# EasyEDA Pro project PowerManager.eprj

# Schematic Schematic1
Create Date: 2024-06-30; Page Name: P1; Project Name: PowerManager; Schematic Name: Schematic1; Update Date: 2024-07-23; Company: 嘉立创EDA; Page Size: A4; Version: V1.0
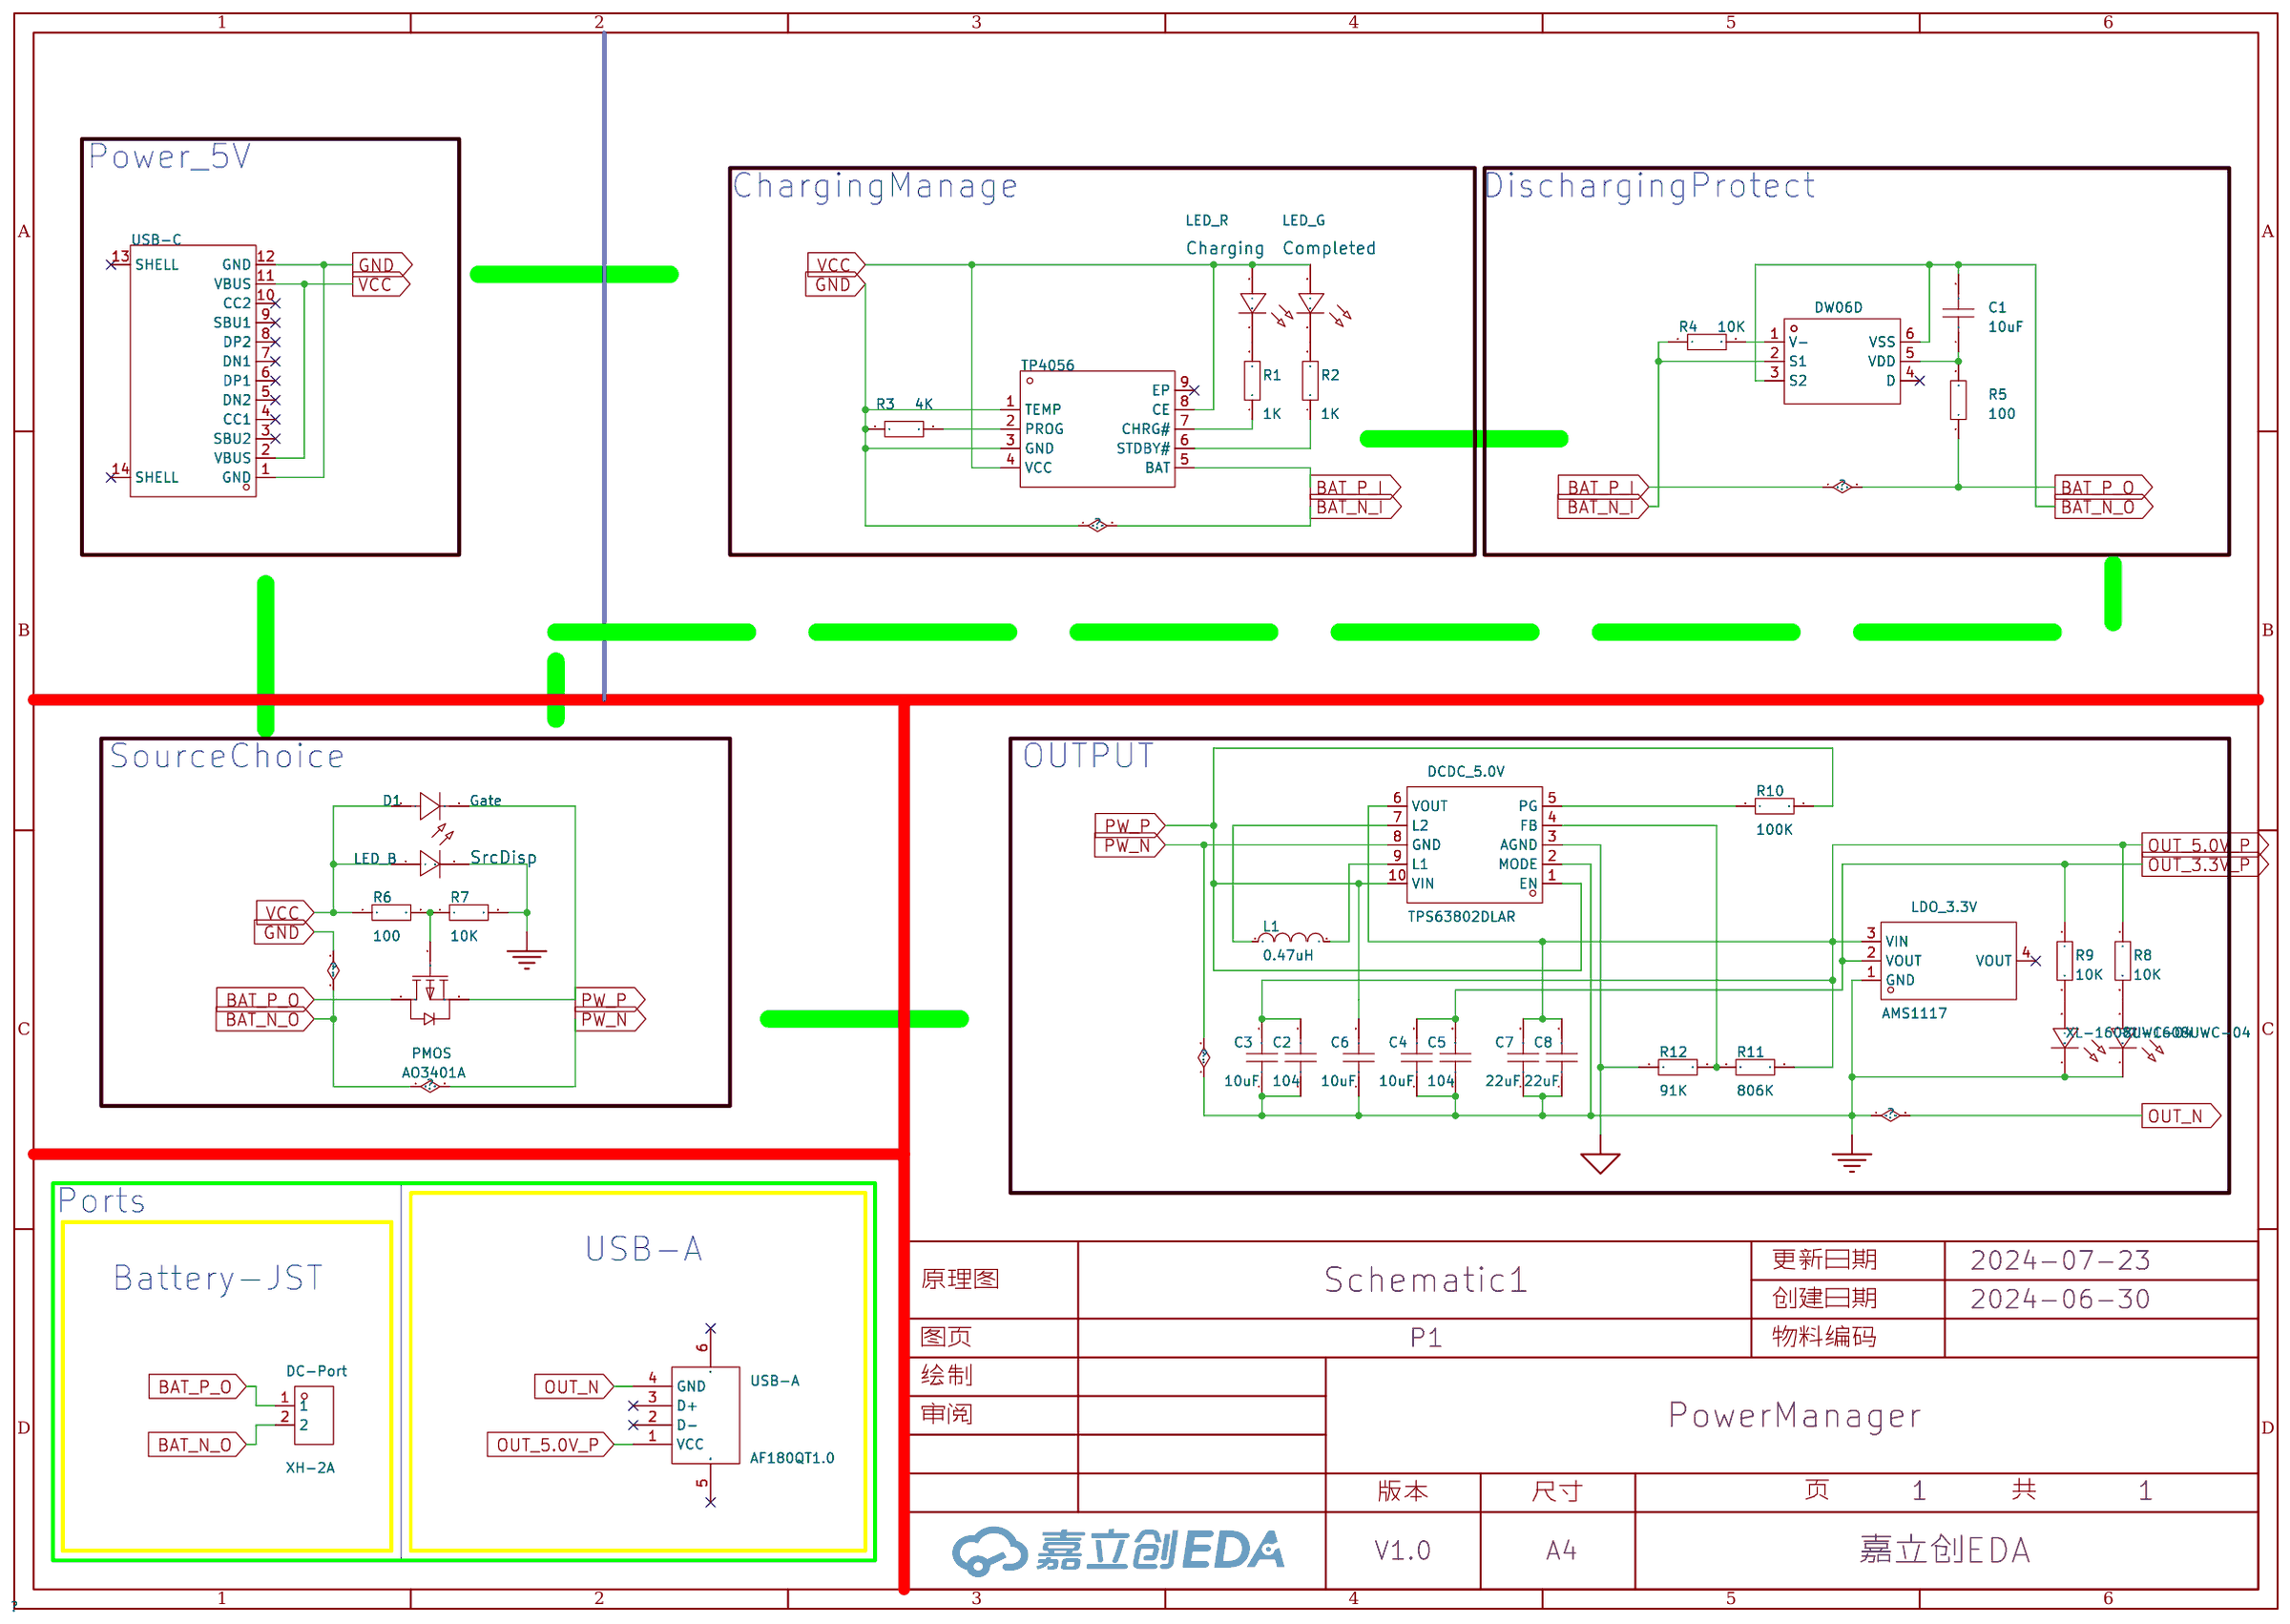
[diagram p0: schematic sheet]

## Parts
3.3V  XL-1608UWC-04  [LED0603-RD_WHITE]
5.0V  XL-1608UWC-04  [LED0603-RD_WHITE]
C1  10uF  [C0603]
C2  104  [C0603]
C3  10uF  [C0603]
C4  104  [C0603]
C5  10uF  [C0603]
C6  10uF  [C0603]
C7  22uF  [C0603]
C8  22uF  [C0603]
Charging  LED_R  [LED_0603]
Completed  LED_G  [LED0603-RD_GREEN]
DC-Port  XH-2A  [CONN-TH_2P-P2.50_HCTL_XH-2A-X]
DCDC_5.0V  TPS63802DLAR  [VSON-10_L3.0-W2.0-P0.50-TL]
DW06D  DW06D  [SOT-23-6_L2.9-W1.6-P0.95-LS2.8-BR]
Gate  D1  [SMA_1N4007]
L1  0.47uH  [L0603]
LDO_3.3V  AMS1117  [SOT-223-3_L6.5-W3.4-P2.30-LS7.0-BR]
PMOS  AO3401A  [SOT-23_L2.9-W1.3-P1.90-LS2.4-BR]
R1  1K  [R0603]
R2  1K  [R0603]
R3  4K  [R0603]
R4  10K  [R0603]
R5  100  [R0603]
R6  100  [R0603]
R7  10K  [R0603]
R8  10K  [R0603]
R9  10K  [R0603]
R10  100K  [R0603]
R11  806K  [R0603]
R12  91K  [R0603]
SrcDisp  LED_B  [LED0603-RD_BLUE]
TP4056  TP4056  [ESOP-8_L4.9-W3.9-P1.27-LS6.0-BL-EP]
Type-C  USB-C  [USB-C-SMD_TYPE-C-6PIN-2MD-073]
USB-A  AF180QT1.0  [USB-A-SMD_AF180QT1.0]

## Library data of the parts
3.3V 5.0V = XL-1608UWC-04: 发光颜色:白色;功率:80mW;正向电流:25mA;主波长:-;透镜颜色:黄色透镜;色温:13700K~19000K;发光角度:120°;载带方式:正贴;工作温度:-30℃~+85℃;; Supplier Part: C965808; Manufacturer: XINGLIGHT(成兴光); Supplier Footprint: 0603; JLCPCB Part Class: Extended Part; Datasheet: https://atta.szlcsc.com/upload/public/pdf/source/20221102/585FFDAF9A16AAB1CA7BDF9640D81A72.pdf; Supplier: LCSC; Emitted Color: 白色; Power Dissipation: 80mW; Forward Current: 25mA; Lens Color: 黄色透镜; Color Temperature: 13700K~19000K; Viewing Angle: 120°; Mounting Sytle: 正贴; Operating Temperature: -30℃~+85℃
C1-C8 = CAP_0603: Supplier Footprint: 0603
Charging = LED_0603-R: Supplier Footprint: 0603
Completed = XL-1608UGC-04: 灯头类型:-;发光颜色:翠绿色;正向电压(VF):-;功率:80mW;正向电流:25mA;主波长:516nm~525nm;二极管配置:独立二极管;透镜颜色:无色透明透镜;色温:-;发光强度:-;发光角度:120°;载带方式:正贴;工作温度:-30℃~+85℃;; Supplier Part: C965804; Manufacturer: XINGLIGHT(成兴光); Manufacturer Part: LED_R; Supplier Footprint: 0603; JLCPCB Part Class: Extended Part; Datasheet: https://atta.szlcsc.com/upload/public/pdf/source/20221102/520D6E465E5CFD1609C8A4DBC80D4018.pdf; Supplier: LCSC; Emitted Color: 翠绿色; Power Dissipation: 80mW; Forward Current: 25mA; Dominant Wavelength: 516nm~525nm; Peak Wavelength: 534nm; Diode Configuration: 独立二极管; Lens Color: 无色透明透镜; Viewing Angle: 120°; Mounting Sytle: 正贴; Operating Temperature: -30℃~+85℃
DC-Port = XH-2A: 插针结构:1x2P;间距:2.5mm;安装方式:直插;参考系列:XH;总PIN数:2P;排数:1;每排PIN数:2;行距:-;额定电流:3A;触头材质:黄铜;触头镀层:锡;工作温度范围:-25℃~+85℃;; LCSC Part Name: 1x2P 间距:2.5mm 直插 系列:XH; Supplier Part: C2908600; Manufacturer: HCTL(华灿天禄); Supplier Footprint: 插件,P=2.5mm; Datasheet: https://atta.szlcsc.com/upload/public/pdf/source/20230711/68D365716984B4AFE576D1D73D61B465.pdf; Supplier: LCSC; Pins Structure: 1x2P; Pitch: 2.5mm; Mounting Style: 直插; Reference Series: XH; Number of Pins: 2P; Number of Rows: 1; Number of PINs Per Row: 2; Current Rating (Max): 3A; Contact Material: 黄铜; Contact Plating: 锡; Operating Temperature Range: -25℃~+85℃
DCDC_5.0V = TPS63802DLAR_C2845237: Supplier Part: C2845237; Manufacturer: TI(德州仪器); Supplier Footprint: VSON-10(2x3); Datasheet: https://www.ti.com/cn/lit/gpn/tps63802; Supplier: LCSC
DW06D = DW06D/J: 二合一锂电池保护 IC; Supplier Part: C82123; Manufacturer: FM(富满); Supplier Footprint: SOT-23-6; Datasheet: https://atta.szlcsc.com/upload/public/pdf/source/20160903/1472896624271.pdf; Supplier: LCSC
Gate = D_1N4007: Supplier Footprint: SMA
L1 = L_0603
LDO_3.3V = AMS1117-3.3_C6186: 输出类型:固定;最大输入电压:-;输出电压:3.3V;最大输出电流:1A;电源纹波抑制比(PSRR):72dB@(120Hz);输出极性:正极;; LCSC Part Name: 输出3.3V 1A; Supplier Part: C6186; Manufacturer: AMS; Supplier Footprint: SOT-223; Datasheet: https://atta.szlcsc.com/upload/public/pdf/source/20180727/C6186_7A095716F0823C02F1997A905E26C086.pdf; Supplier: LCSC; Output Type: 固定; Output Voltage: 3.3V; MAX Output Current: 1A; Power Supply Rejection Ratio (PSRR): 72dB@(120Hz); Dropout Voltage: 1.3V@(800mA); Output Polarity: 正极; Number of Outputs: 1
PMOS = AO3401A_C15127: 类型:1个P沟道;漏源电压(Vdss):30V;连续漏极电流(Id):4A;功率(Pd):1.4W;导通电阻(RDS(on)@Vgs,Id):44mΩ@10V,4.3A;阈值电压(Vgs(th)@Id):1.3V@250uA;; LCSC Part Name: 1个P沟道 耐压:30V 电流:4A; Supplier Part: C15127; Manufacturer: AOS; Supplier Footprint: SOT-23; Datasheet: https://atta.szlcsc.com/upload/public/pdf/source/20160507/1462613609053.pdf; Supplier: LCSC; Type: 1个P沟道; Drain Source Voltage (Vdss): 30V; Continuous Drain Current (Id): 4A; Power Dissipation (Pd): 1.4W; Drain Source On Resistance (RDS(on)@Vgs,Id): 44mΩ@10V,4.3A; Gate Threshold Voltage (Vgs(th)@Id): 1.3V@250uA; Total Gate Charge (Qg@Vgs): 12.2nC@4.5V; Input Capacitance (Ciss@Vds): 1.2nF@15V; Operating Temperature: -55℃~+150℃@(Tj)
R1-R12 = Res_0603: Supplier Footprint: 0603
SrcDisp = XL-1608UBC-04: 发光颜色:蓝色;功率:80mW;正向电流:25mA;主波长:460nm~469nm;透镜颜色:无色透明透镜;色温:-;发光角度:120°;载带方式:正贴;工作温度:-30℃~+85℃;; Supplier Part: C965807; Manufacturer: XINGLIGHT(成兴光); Supplier Footprint: 0603; JLCPCB Part Class: Extended Part; Datasheet: https://atta.szlcsc.com/upload/public/pdf/source/20240218/F76B043D1CDACE9DB8357580572EF0D5.pdf; Supplier: LCSC; Emitted Color: 蓝色; Power Dissipation: 80mW; Forward Current: 25mA; Dominant Wavelength: 460nm~469nm; Peak Wavelength: 475nm; Lens Color: 无色透明透镜; Viewing Angle: 120°; Mounting Sytle: 正贴; Operating Temperature: -30℃~+85℃
TP4056 = TP4056_C725790: Supplier Part: C725790; Manufacturer: UMW(友台半导体); Supplier Footprint: ESOP-8; Datasheet: https://atta.szlcsc.com/upload/public/pdf/source/20231109/CF74897CE79A500F7FE27A45ADCCC631.pdf; Supplier: LCSC
Type-C = TYPE-C 16PIN 2MD(073): 连接器类型:Type-C;标准:-;公母:母;端口数量:1;触点数量:16P;安装方式:卧贴;额定电流 - 电源:5A;工作温度范围:-25℃~+85℃;; LCSC Part Name: Type-C 母 卧贴; Supplier Part: C2765186; Manufacturer: SHOU HAN(首韩); Supplier Footprint: SMD; Datasheet: https://atta.szlcsc.com/upload/public/pdf/source/20211123/39B17C16241EAC15C5E277BDA434118E.pdf; Supplier: LCSC; Gender: 母; Number of Ports: 1; Number of Contacts: 16P; Mounting Style: 卧贴; Current Rating - Power (Max): 5A; Operating Temperature Range: -25℃~+85℃
USB-A = AF180QT1.0: 连接器类型:Type-A;标准:USB 2.0;公母:母;端口数量:1;触点数量:4P;安装方式:卧贴;额定电流 - 电源:-;工作温度范围:-;; LCSC Part Name: Type-A 母 卧贴; Supplier Part: C404963; Manufacturer: SHOU HAN(首韩); Supplier Footprint: SMD; Datasheet: https://atta.szlcsc.com/upload/public/pdf/source/20190722/C404963_FD7C48D0FD141784D3899E0BE1E5ED69.pdf; Supplier: LCSC; Connector Type: Type-A; Standard: USB 2.0; Gender: 母; Number of Ports: 1; Number of Contacts: 4P; Mounting Style: 卧贴

## Nets
AGND: DCDC_5.0V.3(AGND) R12.1
GND: 3.3V.1(C) 5.0V.1(C) C1.2 C2.1 C3.1 C4.1 C5.1 C6.1 C7.1 C8.1 DC-Port.2 DCDC_5.0V.2(MODE) DCDC_5.0V.8(GND) DW06D.2(S1) DW06D.3(S2) DW06D.6(VSS) LDO_3.3V.1(GND) R3.1 R4.1 R7.2 SrcDisp.1(C) TP4056.1(TEMP) TP4056.3(GND) Type-C.1(GND) Type-C.12(GND) USB-A.4(GND)
VCC: Charging.2(A) Completed.2(A) Gate.2(A) R6.1 SrcDisp.2(A) TP4056.4(VCC) TP4056.8(CE) Type-C.2(VBUS) Type-C.11(VBUS)
BAT_P_I: DC-Port.1 PMOS.3(D) R5.1 TP4056.5(BAT)
OUT_3.3V_P: C4.2 C5.2 LDO_3.3V.2(VOUT) R9.1
OUT_5.0V_P: C2.2 C3.2 C7.2 C8.2 DCDC_5.0V.6(VOUT) LDO_3.3V.3(VIN) R8.1 R11.2 USB-A.1(VCC)
PW_P: C6.2 DCDC_5.0V.1(EN) DCDC_5.0V.10(VIN) Gate.1(K) PMOS.2(S) R10.1
$1N753: R3.2 TP4056.2(PROG)
$1N897: Completed.1(C) R2.2
$1N964: Charging.1(C) R1.2
$1N968: R1.1 TP4056.7(CHRG#)
$1N975: R2.1 TP4056.6(STDBY#)
$1N1874: PMOS.1(G) R6.2 R7.1
$1N7526: 5.0V.2(A) R8.2
$1N7553: 3.3V.2(A) R9.2
$1N8307: DW06D.1(V-) R4.2
$1N8437: C1.1 DW06D.5(VDD) R5.2
$1N9793: DCDC_5.0V.9(L1) L1.2
$1N9797: DCDC_5.0V.7(L2) L1.1
$1N10563: DCDC_5.0V.5(PG) R10.2
$1N11159: DCDC_5.0V.4(FB) R11.1 R12.2

Not connected (* = marked no-connect by the designer): DW06D 4(D)*; LDO_3.3V 4(VOUT)*; TP4056 9(EP)*; Type-C 3(SBU2)* 4(CC1)* 5(DN2)* 6(DP1)* 7(DN1)* 8(DP2)* 9(SBU1)* 10(CC2)* 13(SHELL)* 14(SHELL)*; USB-A 2(D-)* 3(D+)* 5(SH1)* 6(SH2)*

## Notes on the sheet
- Power_5V
- ChargingManage
- DischargingProtect
- SourceChoice
- OUTPUT
- Ports
- USB-A
- Battery-JST

# Board PCB1
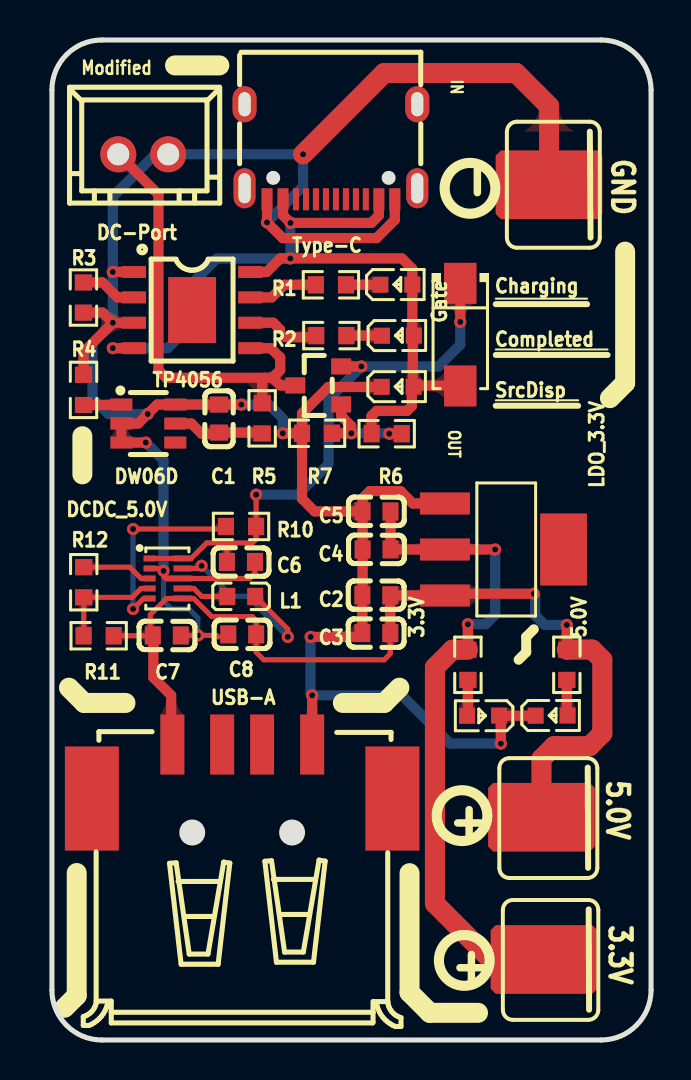
[diagram p1: board, top side]
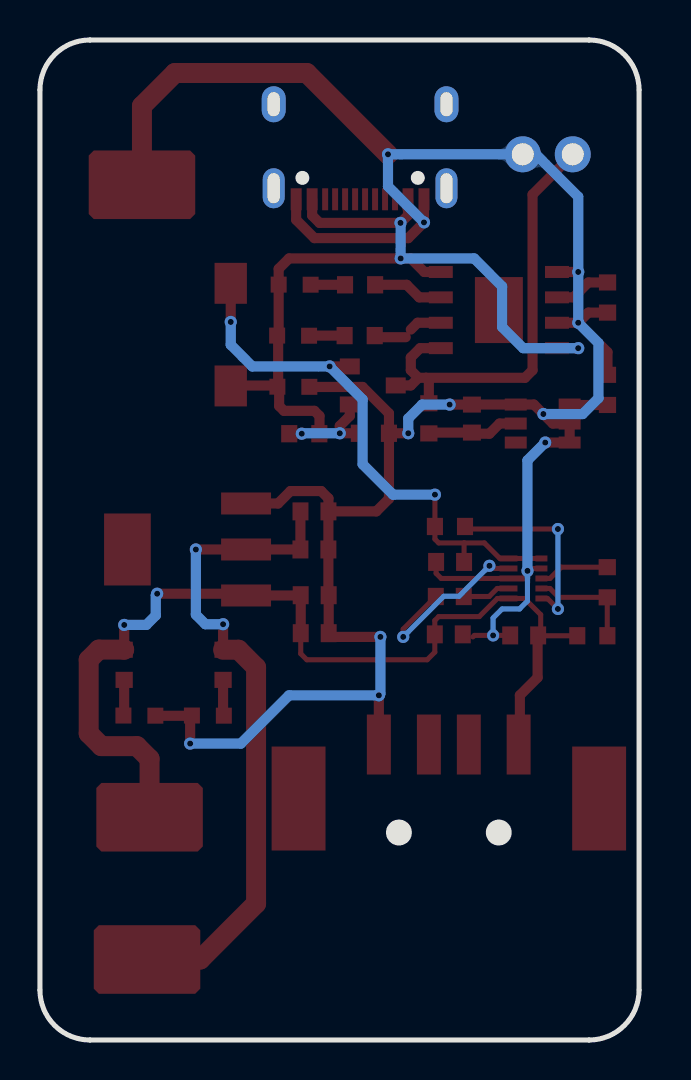
[diagram p2: board, bottom side, seen from below]

Outline 30 x 50 mm; copper layers: Top Layer, Bottom Layer. Coordinates in mm from the lower left corner of the outline.
Outline path: 0,47.5 0,2.5 arc(0.73,0.73) 2.5,0 27.5,0 arc(29.27,0.73) 30,2.5 30,47.5 arc(29.27,49.27) 27.5,50 2.5,50 arc(0.73,49.27) 0,47.5
Stack: Top Layer 0.035mm / Dielectric1 1.51mm FR4 er 4.5 / Bottom Layer 0.035mm

## Design rules (mm)
template: JLCPCB Capability(Two Layers Board)
spacing copperThickness1oz (default): track to track 0.102, other pairs 0.152 to 0.3
spacing copperThickness2oz: track to track 0.203, other pairs 0.152 to 0.3
track width copperThickness1oz (default): min 0.127, default 0.254, max 2.54
track width copperThickness2oz: min 0.203, default 0.254, max 2.54
differential pair differentialPair (default): width min 0.127, default 0.254, max 2.54; gap min 0.152, default 0.152
via viaSize (default): diameter min 0.5, default 0.61, max 10; hole min 0.3, default 0.305, max 6.3

## Placement (name value [footprint] x y rotation side)
3.3V  XL-1608UWC-04  [LED0603-RD_WHITE]  21.59 16.22 180 top
5.0V  XL-1608UWC-04  [LED0603-RD_WHITE]  25.02 16.22 0 top
C1  10uF  [C0603]  8.37 31.07 90 top
C2  104  [C0603]  16.24 22.24 0 top
C3  10uF  [C0603]  16.24 20.34 0 top
C4  104  [C0603]  16.26 24.53 0 top
C5  10uF  [C0603]  16.25 26.43 0 top
C6  10uF  [C0603]  9.46 23.9 180 top
C7  22uF  [C0603]  5.75 20.23 180 top
C8  22uF  [C0603]  9.53 20.28 0 top
Charging  LED_R  [LED_0603]  17.3 37.78 0 top
Completed  LED_G  [LED0603-RD_GREEN]  17.32 35.22 0 top
DC-Port  XH-2A  [CONN-TH_2P-P2.50_HCTL_XH-2A-X]  4.57 44.28 0 top
DCDC_5.0V  TPS63802DLAR  [VSON-10_L3.0-W2.0-P0.50-TL]  5.72 23.08 0 top
DW06D  DW06D  [SOT-23-6_L2.9-W1.6-P0.95-LS2.8-BR]  4.83 30.82 180 top
Gate  D1  [SMA_1N4007]  20.45 35.27 270 top
L1  0.47uH  [L0603]  9.48 22.17 0 top
LDO_3.3V  AMS1117  [SOT-223-3_L6.5-W3.4-P2.30-LS7.0-BR]  22.65 24.53 180 top
NOREF  -  [Pad_e1558]  24.89 42.76 90 top
NOREF#2  -  [Pad_e1557]  24.64 4.03 90 top
NOREF#3  -  [Pad_e1556]  24.51 11.14 90 top
PMOS  AO3401A  [SOT-23_L2.9-W1.3-P1.90-LS2.4-BR]  13.34 32.73 0 top
R1  1K  [R0603]  13.97 37.76 0 top
R2  1K  [R0603]  13.99 35.22 0 top
R3  4K  [R0603]  1.58 37.12 90 top
R4  10K  [R0603]  1.58 32.5 270 top
R5  100  [R0603]  10.53 31.08 270 top
R6  100  [R0603]  16.76 30.31 0 top
R7  10K  [R0603]  13.28 30.34 180 top
R8  10K  [R0603]  25.78 18.76 270 top
R9  10K  [R0603]  20.83 18.76 270 top
R10  100K  [R0603]  9.47 25.68 180 top
R11  806K  [R0603]  2.34 20.21 0 top
R12  91K  [R0603]  1.59 22.89 270 top
SrcDisp  LED_B  [LED0603-RD_BLUE]  17.31 32.66 0 top
TP4056  TP4056  [ESOP-8_L4.9-W3.9-P1.27-LS6.0-BL-EP]  7.02 36.5 270 top
Type-C  USB-C  [USB-C-SMD_TYPE-C-6PIN-2MD-073]  13.97 44.41 180 top
USB-A  AF180QT1.0  [USB-A-SMD_AF180QT1.0]  9.53 13.42 0 top

## Footprints (pads in the part's own frame, mm; a bottom-side part is the same pattern mirrored in y, then rotated)
C0603
  rect 0.8x0.9 smd: 1(-0.7,0) 2(0.7,0)
CONN-TH_2P-P2.50_HCTL_XH-2A-X
  round 1.8 hole 1.1: 1(-1.251,0) 2(1.251,0)
ESOP-8_L4.9-W3.9-P1.27-LS6.0-BL-EP
  rect 0.6x1.2 smd: 1(-1.905,-2.909) 2(-0.635,-2.909) 3(0.635,-2.909) 4(1.905,-2.909) 5(1.905,2.909) 6(0.635,2.909) 7(-0.635,2.909) 8(-1.905,2.909)
  rect 3.3x2.4 smd: 9(0,0)
L0603
  rect 0.8x0.864 smd: 1(-0.7,0) 2(0.7,0)
LED0603-RD_BLUE
  rect 0.8x0.8 smd: 1(-0.799,-0.004) 2(0.799,0.004)
LED0603-RD_GREEN
  rect 0.8x0.8 smd: 1(-0.799,-0.004) 2(0.799,0.004)
LED0603-RD_WHITE
  rect 0.8x0.8 smd: 1(-0.799,-0.004) 2(0.799,0.004)
LED_0603
  rect 0.8x0.8 smd: 1(-0.851,-0.01) 2(0.75,-0.005)
Pad_e1556
  custom 3.429x5.334 smd: B(0,0)
Pad_e1557
  custom 3.429x5.334 smd: C(0,0)
Pad_e1558
  custom 3.429x5.334 smd: A(0,0)
R0603
  rect 0.806x0.864 smd: 1(-0.753,0) 2(0.753,0)
SMA_1N4007
  rect 2.046x1.62 smd: 1(-2.566,0) 2(2.566,0)
SOT-23-6_L2.9-W1.6-P0.95-LS2.8-BR
  rect 1.1x0.6 smd: 1(1.35,-0.95) 2(1.35,0) 3(1.35,0.95) 4(-1.35,0.95) 5(-1.35,0) 6(-1.35,-0.95)
SOT-23_L2.9-W1.3-P1.90-LS2.4-BR
  rect 1x0.8 smd: 1(1.15,-0.95) 2(1.15,0.95) 3(-1.15,0)
SOT-223-3_L6.5-W3.4-P2.30-LS7.0-BR
  rect 2.5x1.1 smd: 1(2.97,-2.3) 2(2.97,0) 3(2.97,2.3)
  rect 2.34x3.6 smd: 4(-2.97,0)
USB-A-SMD_AF180QT1.0
  rect 1.2x3 smd: 1(-3.495,1.35) 2(-1,1.35) 3(1,1.35) 4(3.505,1.35)
  rect 2.7x5.2 smd: 5(7.525,-1.35) 6(-7.525,-1.35)
USB-C-SMD_TYPE-C-6PIN-2MD-073
  rect 0.55x1.1 smd: 1(-3.2,2.375) 2(-2.4,2.375) 11(2.4,2.375) 12(3.2,2.375)
  rect 0.3x1.1 smd: 3(-1.75,2.375) 4(-1.25,2.375) 5(-0.75,2.375) 6(-0.25,2.375) 7(0.25,2.375) 8(0.75,2.375) 9(1.25,2.375) 10(1.75,2.375)
  oval 1.1x2 hole 0.6x1.5: 13(-4.325,1.825) 14(4.325,1.825)
  oval 1.2x1.8 hole 0.6x1.2: 13(-4.325,-2.375) 14(4.325,-2.375)
VSON-10_L3.0-W2.0-P0.50-TL
  rect 0.6x0.3 smd: 1(-0.825,1) 2(-0.825,0.5) 3(-0.825,0) 4(-0.825,-0.5) 5(-0.825,-1)
  rect 0.9x0.3 smd: 6(0.825,-1) 7(0.825,-0.5) 9(0.825,0.5) 10(0.825,1)
  rect 1.3x0.3 smd: 8(0.625,0)

## Nets
As in the schematic, except:
GND: 3.3V.1 5.0V.1 C1.2 C2.1 C3.1 C4.1 C5.1 C6.1 C7.1 C8.1 DC-Port.2 DCDC_5.0V.2 DCDC_5.0V.8 DW06D.2 DW06D.3 DW06D.6 LDO_3.3V.1 NOREF.A R3.1 R4.1 R7.2 SrcDisp.1 TP4056.1 TP4056.3 Type-C.1 Type-C.12 USB-A.4
OUT_3.3V_P: C4.2 C5.2 LDO_3.3V.2 NOREF#2.C R9.1
OUT_5.0V_P: C2.2 C3.2 C7.2 C8.2 DCDC_5.0V.6 LDO_3.3V.3 NOREF#3.B R8.1 R11.2 USB-A.1

Pads without a net: DW06D 4; LDO_3.3V 4; TP4056 9; Type-C 3 4 5 6 7 8 9 10 13 14; USB-A 2 3 5 6

## Via types
v1: diameter 0.61, hole 0.305, Top Layer to Bottom Layer, 29 vias

## Routing (per net, layer and track width the routed paths; a pad name or vN(x,y) marks a point on that pad's centre or on a via; arc(x,y) is an arc through that point)
AGND: length 3.7
  Top Layer w0.254: DCDC_5.0V.3 4.46,23.08 3.9,23.64 1.47,23.64
GND: length 140.3
  Top Layer w0.254: DCDC_5.0V.2 5.47,23.58 v1(5.59,23.46) 5.59,23.2 5.72,23.08 DCDC_5.0V.8 9.91,23.08 10.16,23.33 10.16,23.9 ; 8.32,20.16 8.25,20.23 v1(7.31,20.23) 6.33,20.23
  Top Layer w0.508: R3.1 2.54,36.37 v1(3.05,35.86) ; R7.2 v1(11.56,30.34) ; R7.2 12.52,31.33 13.84,32.65 16.46,32.65 ; R7.2 12.52,27.06 13.15,26.43 C5.1 ; Type-C.1 17.17,41.01 16.26,40.09 11.56,40.09 v1(10.77,40.88) Type-C.12 ; 22.46,16.21 22.48,16.19 v1(22.48,14.82) ; 22.46,16.21 24.17,16.21 ; 22.46,16.21 22.44,16.23 ; v1(3.05,35.86) TP4056.3 ; v1(3.05,35.86) 1.58,34.4 R4.1 ; v1(4.7,29.87) DW06D.3 DW06D.2 4.32,30.82 v1(4.79,31.3) 5.27,31.77 DW06D.6 8.37,31.77 C1.2 v1(9.49,31.77) ; USB-A.4 v1(13.03,17.23) ; C5.1 15.55,27.08 15.92,27.45 17.46,27.45 18.08,26.83 19.68,26.83 ; C5.1 15.56,26.43 15.56,22.25 C2.1 15.54,22.24 C3.1 15.36,20.16 v1(12.95,20.16) ; v1(3.05,38.4) TP4056.1
  Top Layer w1: NOREF.A 24.89,46.7 23.24,48.35 16.64,48.35 v1(12.57,44.28)
  Bottom Layer w0.254: v1(5.59,23.46) 5.59,21.95 5.99,21.55 6.86,21.55 7.31,21.1 v1(7.31,20.23)
  Bottom Layer w0.508: v1(11.56,30.34) 11.56,31.08 10.86,31.77 v1(9.49,31.77) ; v1(4.79,31.3) 2.83,31.3 2.03,32.09 2.03,34.85 v1(3.05,35.86) v1(3.05,38.4) 3.05,42.16 5.17,44.28 DC-Port.2 v1(12.57,44.28) 12.57,42.68 v1(10.77,40.88) ; v1(12.95,20.16) 12.95,17.31 v1(13.03,17.23) 17.53,17.23 19.94,14.82 v1(22.48,14.82) ; v1(4.7,29.87) 5.59,28.98 v1(5.59,23.46)
VCC: length 42.6
  Top Layer w0.508: TP4056.4 v1(3.05,34.59) ; 18.02,32.72 18.07,32.77 18.07,35.21 18.05,35.24 Charging.2 18.05,38.56 17.53,39.08 v1(11.94,39.08) 11.43,39.08 10.75,38.4 TP4056.8 ; 18.02,32.72 18.02,31.7 17.78,31.46 16.26,31.46 16,31.2 16,30.32 R6.1 ; 18.02,32.72 20.43,32.72 Gate.2 ; Type-C.11 11.57,41.23 v1(11.95,40.86) 16,40.86 16.37,41.22 Type-C.2
  Bottom Layer w0.508: v1(11.95,40.86) 11.94,40.85 v1(11.94,39.08) 8.25,39.08 6.86,37.68 6.86,35.65 5.8,34.59 v1(3.05,34.59)
BAT_P_I: length 23
  Top Layer w0.508: 11.05,33.11 11.43,33.49 11.43,34.12 10.96,34.59 TP4056.5 ; 11.05,33.11 10.67,33.11 ; 11.05,33.11 11.43,32.73 PMOS.3 ; 10.67,33.11 5.72,33.11 5.33,33.49 5.33,42.27 DC-Port.1 ; 10.67,33.11 10.53,32.97 R5.1
OUT_3.3V_P: length 33.7
  Top Layer w0.508: C4.2 16.96,26.43 C5.2 ; R9.1 v1(20.83,20.79) ; v1(22.19,24.53) 16.96,24.53
  Top Layer w1: NOREF#2.C 21.97,4.03 19.18,6.82 19.18,18.63 20.06,19.51 R9.1
  Bottom Layer w0.508: 20.83,20.79 21.72,20.79 22.19,21.27 v1(22.19,24.53)
OUT_5.0V_P: length 49.9
  Top Layer w0.254: C3.2 16.94,19.32 16.64,19.01 10.61,19.01 10.23,19.39 C8.2 10.23,20.98 10.03,21.17 8,21.17 7.1,22.08 DCDC_5.0V.6 5.74,22.08 4.93,21.27 4.93,20.23 4.91,20.21 R11.2
  Top Layer w0.508: 4.93,20.23 5.08,20.08 5.08,18.12 5.97,17.23 5.97,14.83 USB-A.1 ; v1(24.13,22.31) 19.77,22.31 19.68,22.23 16.96,22.23 C2.2 16.94,22.24 C3.2 ; v1(25.78,20.75) 25.78,19.51
  Top Layer w1: R8.1 25.79,19.52 27.05,19.52 27.56,19.01 27.56,15.33 26.92,14.69 25.15,14.69 24.51,14.06 NOREF#3.B
  Bottom Layer w0.508: v1(25.78,20.75) 24.68,20.75 24.2,21.23 24.2,22.25 v1(24.13,22.31)
PW_P: length 28.2
  Top Layer w0.254: DCDC_5.0V.1 DCDC_5.0V.10 6.97,24.08 7.75,24.85 8.76,24.85 ; 8.76,24.85 8.76,24.85 C6.2 ; 8.76,24.85 10.03,24.85 10.22,25.04 R10.1 v1(10.22,27.27)
  Top Layer w0.508: PMOS.2 v1(15.49,33.68) ; v1(20.45,35.9) Gate.1
  Bottom Layer w0.508: v1(10.22,27.27) 12.32,27.27 13.84,28.79 13.84,32.03 v1(15.49,33.68) 19.37,33.68 20.45,34.76 v1(20.45,35.9)
$1N753: length 2.8
  Top Layer w0.508: 1.58,37.88 2.54,37.88 3.28,37.13 TP4056.2
$1N897: length 1.7
  Top Layer w0.508: 16.47,35.21 16.46,35.22 14.74,35.22
$1N964: length 1.7
  Top Layer w0.508: Charging.1 16.44,37.76 R1.2
$1N968: length 3.5
  Top Layer w0.508: TP4056.7 11.01,37.13 11.64,37.76 R1.1
$1N975: length 3.2
  Top Layer w0.508: TP4056.6 11.09,35.86 11.43,35.52 ; R2.1 13.16,35.14 11.68,35.14
$1N1874: length 5.1
  Top Layer w0.508: v1(16.89,30.31) R6.2 ; R7.1 v1(14.99,30.34) 14.99,30.7 14.49,31.2 PMOS.1
  Bottom Layer w0.508: v1(16.89,30.31) 16.87,30.34 v1(14.99,30.34)
$1N7526: length 1.8
  Top Layer w0.508: R8.2 25.78,16.23 25.77,16.21
$1N7553: length 1.8
  Top Layer w0.508: 20.84,16.22 20.83,16.24 R9.2
$1N8307: length 1.9
  Top Layer w0.508: 1.58,31.75 3.45,31.75 DW06D.1
$1N8437: length 4.6
  Top Layer w0.508: DW06D.5 6.99,30.82 7.49,30.31 8.31,30.31 C1.1 10.49,30.37 10.53,30.33
$1N9793: length 9.5
  Top Layer w0.254: DCDC_5.0V.9 7.36,23.58 v1(7.49,23.71) ; L1.2 11.81,20.54 v1(11.81,20.16)
  Bottom Layer w0.254: v1(11.81,20.16) 9.78,22.19 9.02,22.19 v1(7.49,23.71)
$1N9797: length 2.4
  Top Layer w0.254: DCDC_5.0V.7 7.1,22.58 7.5,22.17 L1.1
$1N10563: length 9.7
  Top Layer w0.254: v1(4.06,25.55) 8.59,25.55 R10.2 ; DCDC_5.0V.5 4.59,22.08 v1(4.06,21.55)
  Bottom Layer w0.254: v1(4.06,25.55) v1(4.06,21.55)
$1N11159: length 5.5
  Top Layer w0.254: R12.2 1.59,20.22 R11.1 ; R12.2 4.02,22.13 4.46,22.58 DCDC_5.0V.4 ; R12.2 1.47,22.13

## Copper pours and planes (outline as drawn; the poured copper is in the pictures)
GND on Top Layer: 0,50 30.23,50 30.23,-0.16 0,-0.16
GND on Bottom Layer: 0,50 30.23,50 30.23,-0.16 0,-0.16

Small or netless copper shapes (teardrops, artwork), in the pictures only: 134 on Top Layer, 13 on Bottom Layer

## Text on the board
Top Silkscreen Layer: OUT | IN | Modified | 3.3V | GND | 5.0V | + | -
